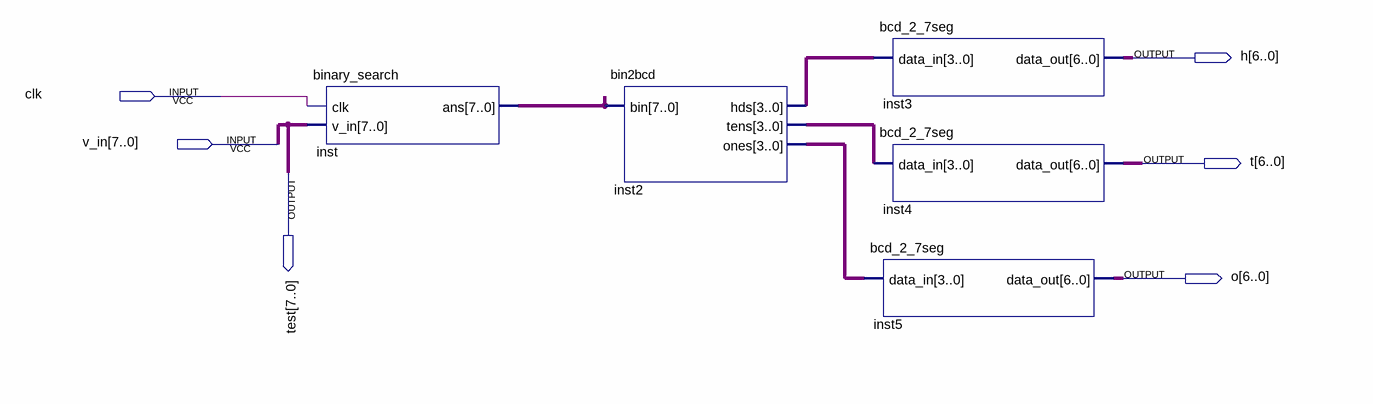
[diagram p0: schematic sheet]
// Quartus schematic experiment_3.bdf as structural Verilog: 5 symbols, 6 pins
module experiment_3 (
  input  clk,
  input  [7:0] v_in,
  output [6:0] h,
  output [6:0] t,
  output [7:0] test,
  output [6:0] o
);

  wire [3:0] inst2_hds, inst2_ones, inst2_tens;
  wire [7:0] inst_ans;

  binary_search inst (.clk(clk), .v_in(v_in), .ans(inst_ans));
  bin2bcd inst2 (.bin(inst_ans), .hds(inst2_hds), .tens(inst2_tens), .ones(inst2_ones));
  bcd_2_7seg inst3 (.data_in(inst2_hds), .data_out(h));
  bcd_2_7seg inst4 (.data_in(inst2_tens), .data_out(t));
  bcd_2_7seg inst5 (.data_in(inst2_ones), .data_out(o));

  assign test = v_in;
endmodule
